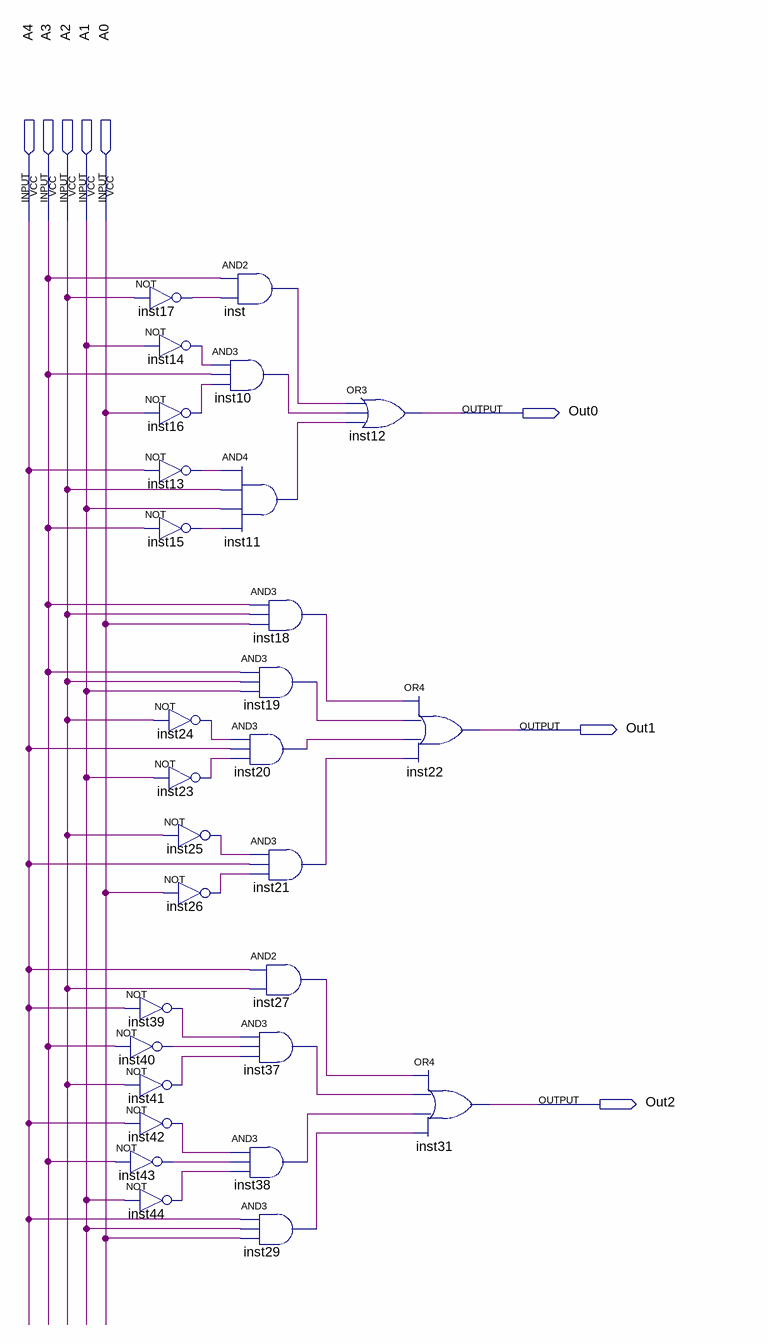
[diagram p0: schematic sheet]
// Quartus schematic lab2p2decoder.bdf as structural Verilog: 29 symbols, 8 pins
module lab2p2decoder (
  input  A4,
  input  A3,
  input  A2,
  input  A1,
  input  A0,
  output Out0,
  output Out1,
  output Out2
);

  wire inst10_out, inst11_out, inst13_out, inst14_out, inst15_out, inst16_out, inst17_out, inst18_out,
       inst19_out, inst20_out, inst21_out, inst23_out, inst24_out, inst25_out, inst26_out, inst27_out,
       inst29_out, inst37_out, inst38_out, inst39_out, inst40_out, inst41_out, inst42_out, inst43_out,
       inst44_out, inst_out;

  not inst39 (inst39_out, A4);
  not inst40 (inst40_out, A3);
  not inst41 (inst41_out, A2);
  not inst42 (inst42_out, A4);
  not inst43 (inst43_out, A3);
  not inst44 (inst44_out, A1);
  not inst17 (inst17_out, A2);
  not inst14 (inst14_out, A1);
  not inst16 (inst16_out, A0);
  not inst13 (inst13_out, A4);
  not inst15 (inst15_out, A3);
  not inst24 (inst24_out, A2);
  not inst23 (inst23_out, A1);
  not inst25 (inst25_out, A2);
  not inst26 (inst26_out, A0);
  and inst (inst_out, A3, inst17_out);
  and inst10 (inst10_out, inst14_out, A3, inst16_out);
  and inst11 (inst11_out, inst13_out, A2, A1, inst15_out);
  and inst18 (inst18_out, A3, A2, A0);
  and inst19 (inst19_out, A3, A2, A1);
  and inst20 (inst20_out, inst24_out, A4, inst23_out);
  and inst21 (inst21_out, inst25_out, A4, inst26_out);
  and inst27 (inst27_out, A4, A2);
  and inst37 (inst37_out, inst39_out, inst40_out, inst41_out);
  and inst38 (inst38_out, inst42_out, inst43_out, inst44_out);
  and inst29 (inst29_out, A4, A1, A0);
  or inst12 (Out0, inst_out, inst10_out, inst11_out);
  or inst22 (Out1, inst18_out, inst19_out, inst20_out, inst21_out);
  or inst31 (Out2, inst27_out, inst37_out, inst38_out, inst29_out);
endmodule
